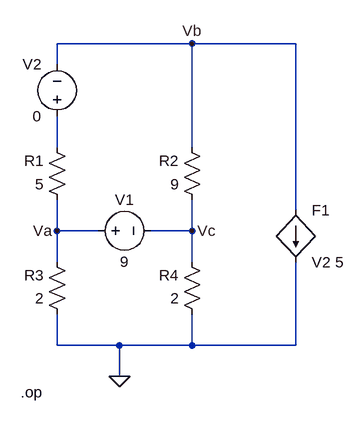
[diagram p0: schematic E3.asc]
E3.asc, the LTspice schematic file:
Version 4.1
SHEET 1 880 680
WIRE 288 -48 80 -48
WIRE 448 -48 288 -48
WIRE 80 -16 80 -48
WIRE 80 112 80 64
WIRE 288 112 288 -48
WIRE 448 208 448 -48
WIRE 80 240 80 192
WIRE 144 240 80 240
WIRE 288 240 288 192
WIRE 288 240 224 240
WIRE 80 288 80 240
WIRE 288 288 288 240
WIRE 80 416 80 368
WIRE 176 416 80 416
WIRE 288 416 288 368
WIRE 288 416 176 416
WIRE 448 416 448 288
WIRE 448 416 288 416
WIRE 176 464 176 416
FLAG 176 464 0
FLAG 80 240 Va
FLAG 288 -48 Vb
FLAG 288 240 Vc
SYMBOL res 96 208 R180
WINDOW 0 36 76 Left 2
WINDOW 3 36 40 Left 2
SYMATTR InstName R1
SYMATTR Value 5
SYMBOL res 304 208 R180
WINDOW 0 36 76 Left 2
WINDOW 3 36 40 Left 2
SYMATTR InstName R2
SYMATTR Value 9
SYMBOL res 96 384 R180
WINDOW 0 36 76 Left 2
WINDOW 3 36 40 Left 2
SYMATTR InstName R3
SYMATTR Value 2
SYMBOL res 304 384 R180
WINDOW 0 36 76 Left 2
WINDOW 3 36 40 Left 2
SYMATTR InstName R4
SYMATTR Value 2
SYMBOL voltage 128 240 R270
WINDOW 0 32 56 VTop 2
WINDOW 3 -32 56 VBottom 2
WINDOW 123 0 0 Left 0
WINDOW 39 0 0 Left 0
SYMATTR InstName V1
SYMATTR Value 9
SYMBOL f 448 208 R0
SYMATTR InstName F1
SYMATTR Value V2 5
SYMBOL voltage 80 80 R180
WINDOW 0 24 96 Left 2
WINDOW 3 24 16 Left 2
WINDOW 123 0 0 Left 0
WINDOW 39 0 0 Left 0
SYMATTR InstName V2
SYMATTR Value 0
TEXT 24 488 Left 2 !.op

The netlist it stands for:
* E3.asc
R1 Va N001 5
R2 Vc Vb 9
R3 0 Va 2
R4 0 Vc 2
V1 Va Vc 9
F1 Vb 0 V2 5
V2 N001 Vb 0
.op
.backanno
.end